# Altium schematic sheet MCU.SchDoc
size A; SheetNumber: 2; SheetTotal: 4
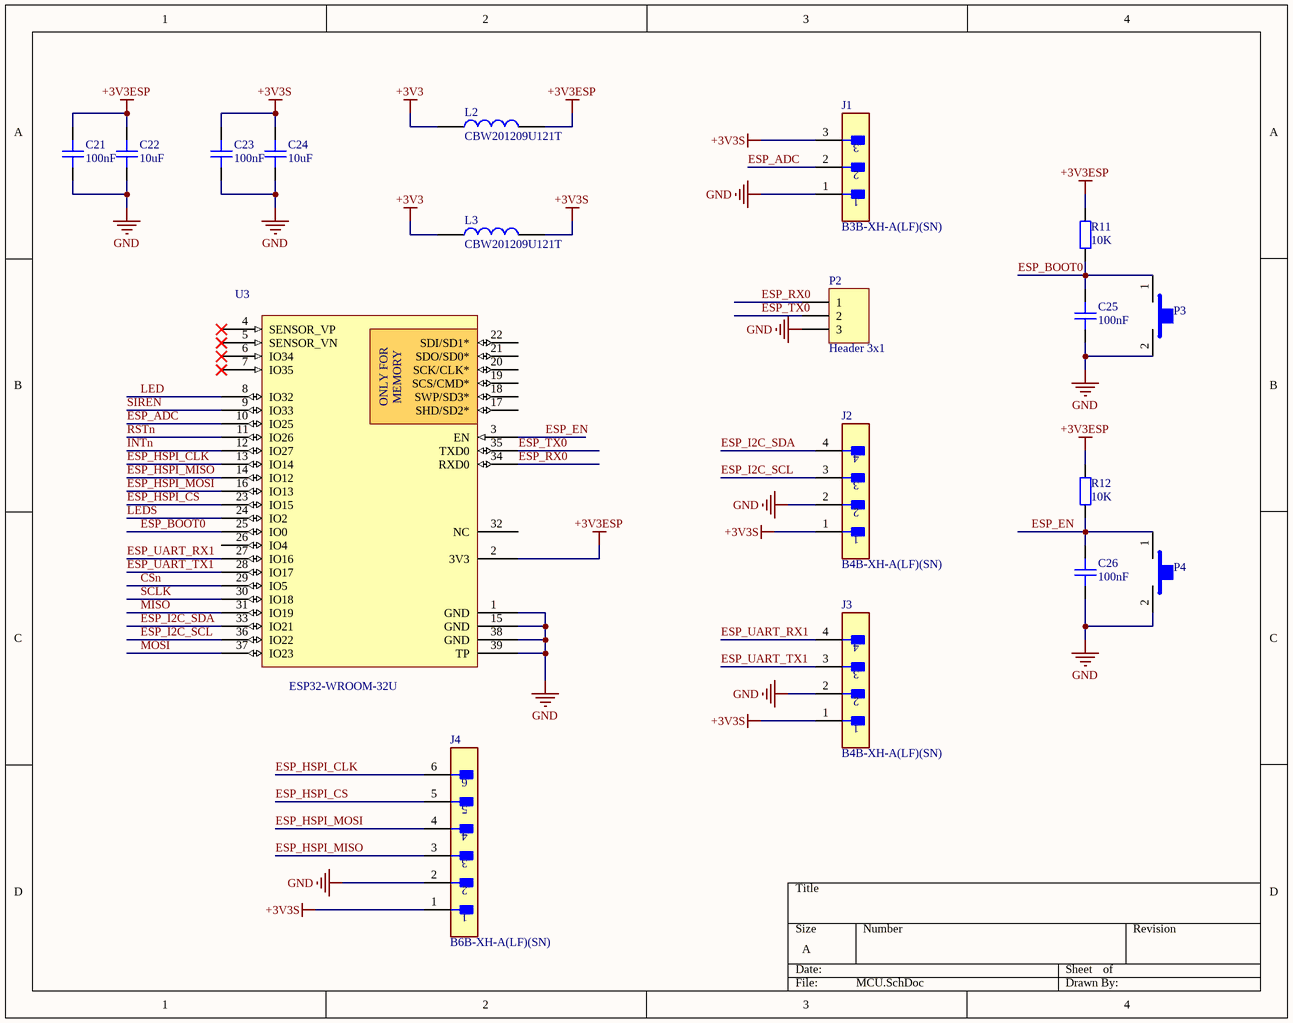
[diagram p0: MCU.SchDoc]

## Parts
C21  100nF  [CAPC-0603 (1608)]
C22  10uF  [CAPC-0603 (1608)]
C23  100nF  [CAPC-0603 (1608)]
C24  10uF  [CAPC-0603 (1608)]
C25  100nF  [CAPC-0603 (1608)]
C26  100nF  [CAPC-0603 (1608)]
J1  B3B-XH-A(LF)(SN)  [FP-B3B-XH-A_LF_SN-MFG]
J2  B4B-XH-A(LF)(SN)  [FP-B4B-XH-A_LF_SN-MFG]
J3  B4B-XH-A(LF)(SN)  [FP-B4B-XH-A_LF_SN-MFG]
J4  B6B-XH-A(LF)(SN)  [FP-B6B-XH-A_LF_SN-MFG]
L2  CBW201209U121T  [IND-0805 (2012)]
L3  CBW201209U121T  [IND-0805 (2012)]
P2  Header 3x1  [HDR1X3]
P3  (no value)  [SW 2P SMD]
P4  (no value)  [SW 2P SMD]
R11  10K  [RESC-0603 (1608)]
R12  10K  [RESC-0603 (1608)]
U3  ESP32-WROOM-32U  [ESP32-WROOM-32U]

## Nets
+3V3: L2.2 L3.2
+3V3ESP: C21.2 C22.2 L2.1 R11.2 R12.2 U3.2(3V3)
+3V3S: C23.2 C24.2 J1.3 J2.1 J3.1 J4.1 L3.1
GND: C21.1 C22.1 C23.1 C24.1 C25.1 C26.1 J1.1 J2.2 J3.2 J4.2 P2.3 P3.2 P4.2 U3.1(GND) U3.15(GND) U3.38(GND) U3.39(TP)
CSn: U3.29(IO5)
ESP_ADC: J1.2 U3.10(IO25)
ESP_BOOT0: C25.2 P3.1 R11.1 U3.25(IO0)
ESP_EN: C26.2 P4.1 R12.1 U3.3(EN)
ESP_HSPI_CLK: J4.6 U3.13(IO14)
ESP_HSPI_CS: J4.5 U3.23(IO15)
ESP_HSPI_MISO: J4.3 U3.14(IO12)
ESP_HSPI_MOSI: J4.4 U3.16(IO13)
ESP_I2C_SCL: J2.3 U3.36(IO22)
ESP_I2C_SDA: J2.4 U3.33(IO21)
ESP_RX0: P2.1 U3.34(RXD0)
ESP_TX0: P2.2 U3.35(TXD0)
ESP_UART_RX1: J3.4 U3.27(IO16)
ESP_UART_TX1: J3.3 U3.28(IO17)
INTn: U3.12(IO27)
LED: U3.8(IO32)
LEDS: U3.24(IO2)
MISO: U3.31(IO19)
MOSI: U3.37(IO23)
RSTn: U3.11(IO26)
SCLK: U3.30(IO18)
SIREN: U3.9(IO33)

Not connected (* = marked no-connect by the designer): U3 4(SENSOR_VP)* 5(SENSOR_VN)* 6(IO34)* 7(IO35)* 17(SHD/SD2*) 18(SWP/SD3*) 19(SCS/CMD*) 20(SCK/CLK*) 21(SDO/SD0*) 22(SDI/SD1*) 26(IO4) 32(NC)

## Notes on the sheet
- (in symbol ESP32-WROOM-32U) ONLY FOR; MEMORY

## Library data of the parts
C21 C23 = CC0603KRX7R7BB105: CAP CER 1uF 10% 16V X7R 0603; Value: 105/16V; CompanyID: VT-00017; Solder: SMT; MPN: CC0603KRX7R7BB105; Category: CAPACITOR; PinCount: 2
C22 C24 = CC0603JRX7R9BB183: CAP CER 0.018UF 50V X7R 0603; MFR: Yageo; Value: 183/50V; Solder: SMT; MPN: CC0603JRX7R9BB183; Category: CAPACITOR; PinCount: 2
C25 C26 = CC0603ZRY5V9BB224: CAP CER 0.22UF 50V Y5V 0603; Value: 224/50V; Solder: SMT; MPN: CC0603ZRY5V9BB224; Category: CAPACITOR; PinCount: 2
J1 = CMP-17439-000014-3: CONN HEADER VERT 3POS 2.5MM; Max Voltage Rating (DC): 250V; Number of Positions: 3; Current Rating: 3A; Gender: Male; Wire/Cable Gauge: 22AWG; Contact Resistance: 20mR; Insulation Resistance: 1GR; Insulation Material: Nylon; Contact Plating: Tin; Depth: 5.75mm; Contact Type: Male Pin; Max Operating Temperature: 85°C; Insulation Color: Natural; Voltage Rating (AC): 250V; Color: Natural; Connector Type: Header; Orientation: Straight; Fastening Type: Detent; Housing Color: White; Min Operating Temperature: -25°C; Termination: Solder; Voltage Rating: 250V; Series: XH; Pitch: 2.5mm; Contact Shape: Square; Number of Rows: 1; Lead Free: Lead Free; Packaging: Bulk; Mount: Through Hole; Flammability Rating: UL94 V-0; Max Voltage Rating (AC): 250V; REACH SVHC: No SVHC; Housing Material: Polyamide; Contact Material: Brass; Lead Pitch: 2.5mm; Contact Finish - Mating: TIN; Length: 9.9mm; Max Current Rating: 3A; Number of Contacts: 3
J2 J3 = CMP-17439-000250-1: CONN HEADER VERT 4POS 2.5MM; Number of Contacts: 4; Contact Resistance: 20mR; Voltage Rating: 250V; Max Current Rating: 3A; Gender: Male; Wire/Cable Gauge: 22AWG; Mated Stacking Heights: 9.8mm; Insulation Resistance: 1GR; Orientation: Straight; Contact Type: Male Pin; Contact Finish - Mating: TIN; Series: XH; Max Voltage Rating (AC): 250V; Lead Pitch: 2.5mm; Contact Shape: Square; Insulation Color: Natural; Termination: Solder; Lead Free: Lead Free; Voltage Rating (AC): 250V; Number of Rows: 1; Flammability Rating: UL94 V-0; Number of Positions: 4; Max Operating Temperature: 85°C; Package Quantity: 500; Mount: Through Hole; REACH SVHC: No SVHC; Connector Type: Header; Insulation Material: Nylon; Fastening Type: Detent; Min Operating Temperature: -25°C; Housing Color: White; Packaging: Bulk; Contact Plating: Tin; Contact Material: Brass; Max Voltage Rating (DC): 250V; Housing Material: Polyamide; Color: Natural; Material: Polyamide; Pitch: 2.5mm; Depth: 5.75mm; Current Rating: 3A; Length: 12.4mm
J4 = CMP-17439-000076-1: CONN HEADER VERT 6POS 2.5MM
L2 L3 = MPZ2012S221A: IND-FERRITE BEAD 220 OHM 0805 1LN; CompanyID: VT-00253; Solder: SMT; Value: 220OHM/3A; MPN: MPZ2012S221A; Category: FERRITE BEAD; PinCount: 2
P2 = Header 3x1: Header, 3-Pin, pitch 2.54mm; Solder: WAVE
P3 P4 = Button 2 SMD: SMD Mini Push Button Switch 2 Pin 3x6x2.7mm; MPN: SMD Mini Push Button 2 SMD; Link: https://ram-e-shop.com/product/press2pin-smd/
R11 R12 = RC0603FR-0710KL: RES SMD 10K OHM 1% 1/10W 0603; CompanyID: VT-00328; Solder: SMT; MPN: RC0603FR-0710KL; Value: 10K; Category: RESISTOR
U3 = ESP32-WROOM-32U: Wi-Fi/BT BLE Module ESP32-D0WD; MFR: Espressif; Solder: SMT; Price: None; Value: ESP32-WROOM-32U; Category: MODULE; MPN: ESP32-WROOM-32U; PinCount: 40